# EAGLE schematic daughter-mux (EAGLE 6.6.0)
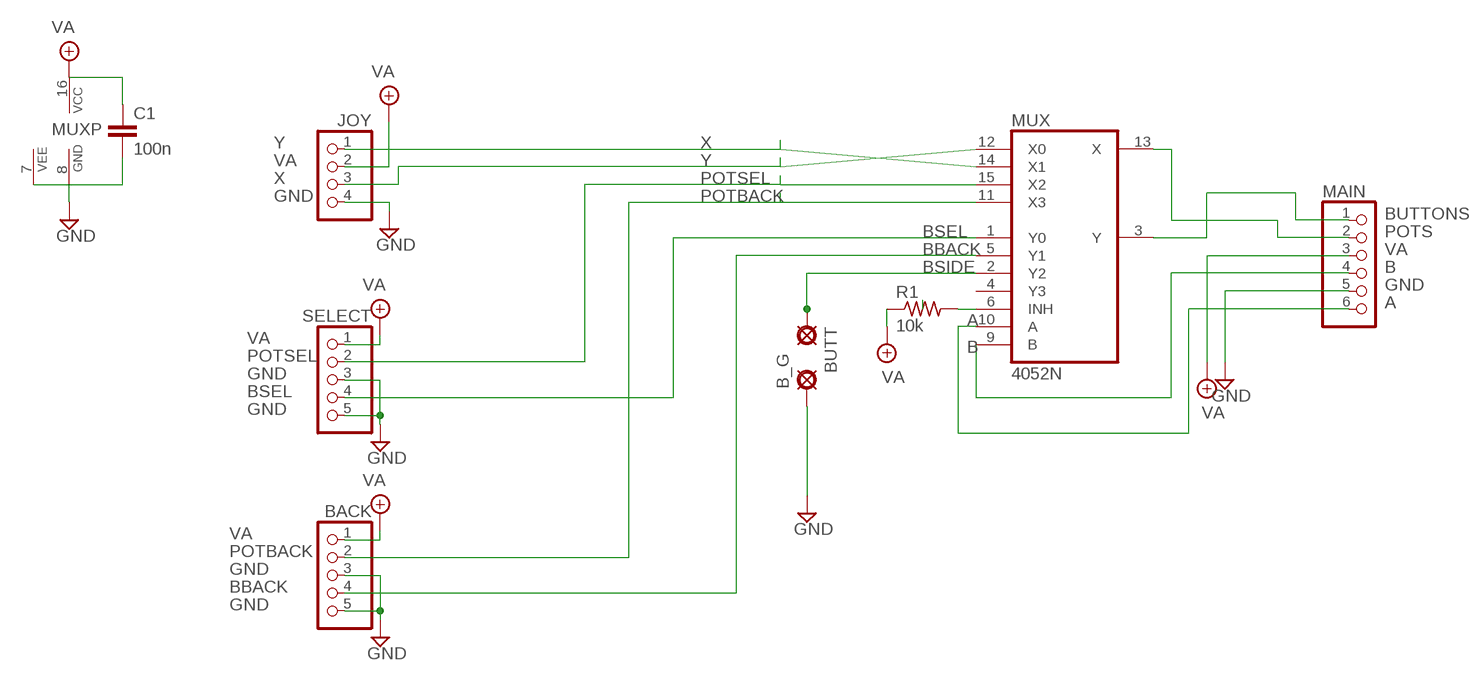
[diagram p0: schematic, sheet 1]

## Parts
B_G  PAD8  [OCTOGON]
BACK  PINHD-1X5  [1X05]
BUTT  PAD  [SQUARE]
C1  100n  050X030_050  [050X030_050_3]
JOY  PINHD-1X4  [1X04]
MAIN  PINHD-1X6  [1X06]
MUX  4052N  [DIL16]
R1  10k  6MM.6  [R0207/6]
SELECT  PINHD-1X5  [1X05]

## Nets
A: MAIN.6 MUX.10(A)
B: MAIN.4 MUX.9(B)
BBACK: BACK.4 MUX.5(Y1)
BSEL: MUX.1(Y0) SELECT.4
BSIDE: BUTT.1(PAD) MUX.2(Y2)
BUTTONS: MAIN.1 MUX.3(Y)
GND: B_G.1(PAD) BACK.3 BACK.5 C1.2 JOY.4 MAIN.5 MUX.7(VEE) MUX.8(GND) SELECT.3 SELECT.5
N$1: MUX.6(INH) R1.2
POTBACK: BACK.2 MUX.11(X3)
POTS: MAIN.2 MUX.13(X)
POTSEL: MUX.15(X2) SELECT.2
VA: BACK.1 C1.1 JOY.2 MAIN.3 MUX.16(VCC) R1.1 SELECT.1
X: JOY.1 MUX.14(X1)
Y: JOY.3 MUX.12(X0)
Unconnected: MUX.4(Y3)

## Library data of the parts
B_G BUTT = gm-supply:PAD: PAD use this package for pads with any purpose, including input, output, send or return various pad shapes: round, square, octogonal, long, and long offset
BACK SELECT = pinhead:PINHD-1X5: PIN HEADER
C1 = gm-caps-ceramic:050X030_050: 120 - 150pF Xicon Ceramic Disc 5mm lead spacing
JOY = pinhead:PINHD-1X4: PIN HEADER
MAIN = pinhead:PINHD-1X6: PIN HEADER
MUX = 40xx:4052: Dual 4-channel ANALOG MULTIPLEXER
R1 = gm-resistors:6MM: 6mm Resistors Leads spaced 1-6 holes apart for 0.1" perfboard. Suitable for 1/4 watt resistors.